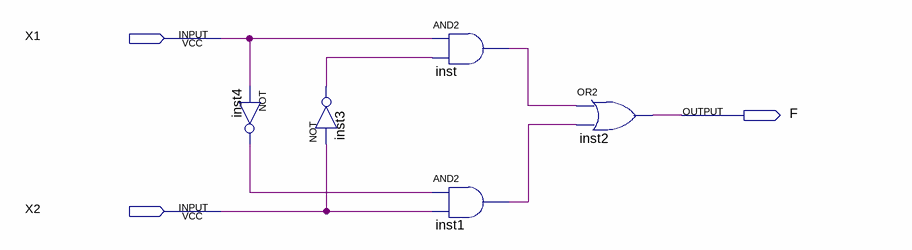
[diagram p0: schematic sheet]
// Quartus schematic light.bdf as structural Verilog: 5 symbols, 3 pins
module light (
  input  X1,
  input  X2,
  output F
);

  wire inst1_out, inst3_out, inst4_out, inst_out;

  not inst4 (inst4_out, X1);
  not inst3 (inst3_out, X2);
  and inst (inst_out, X1, inst3_out);
  and inst1 (inst1_out, inst4_out, X2);
  or inst2 (F, inst_out, inst1_out);
endmodule
